# Altium project BLDC_Motor_Driver_MCUBoard.PrjPcb
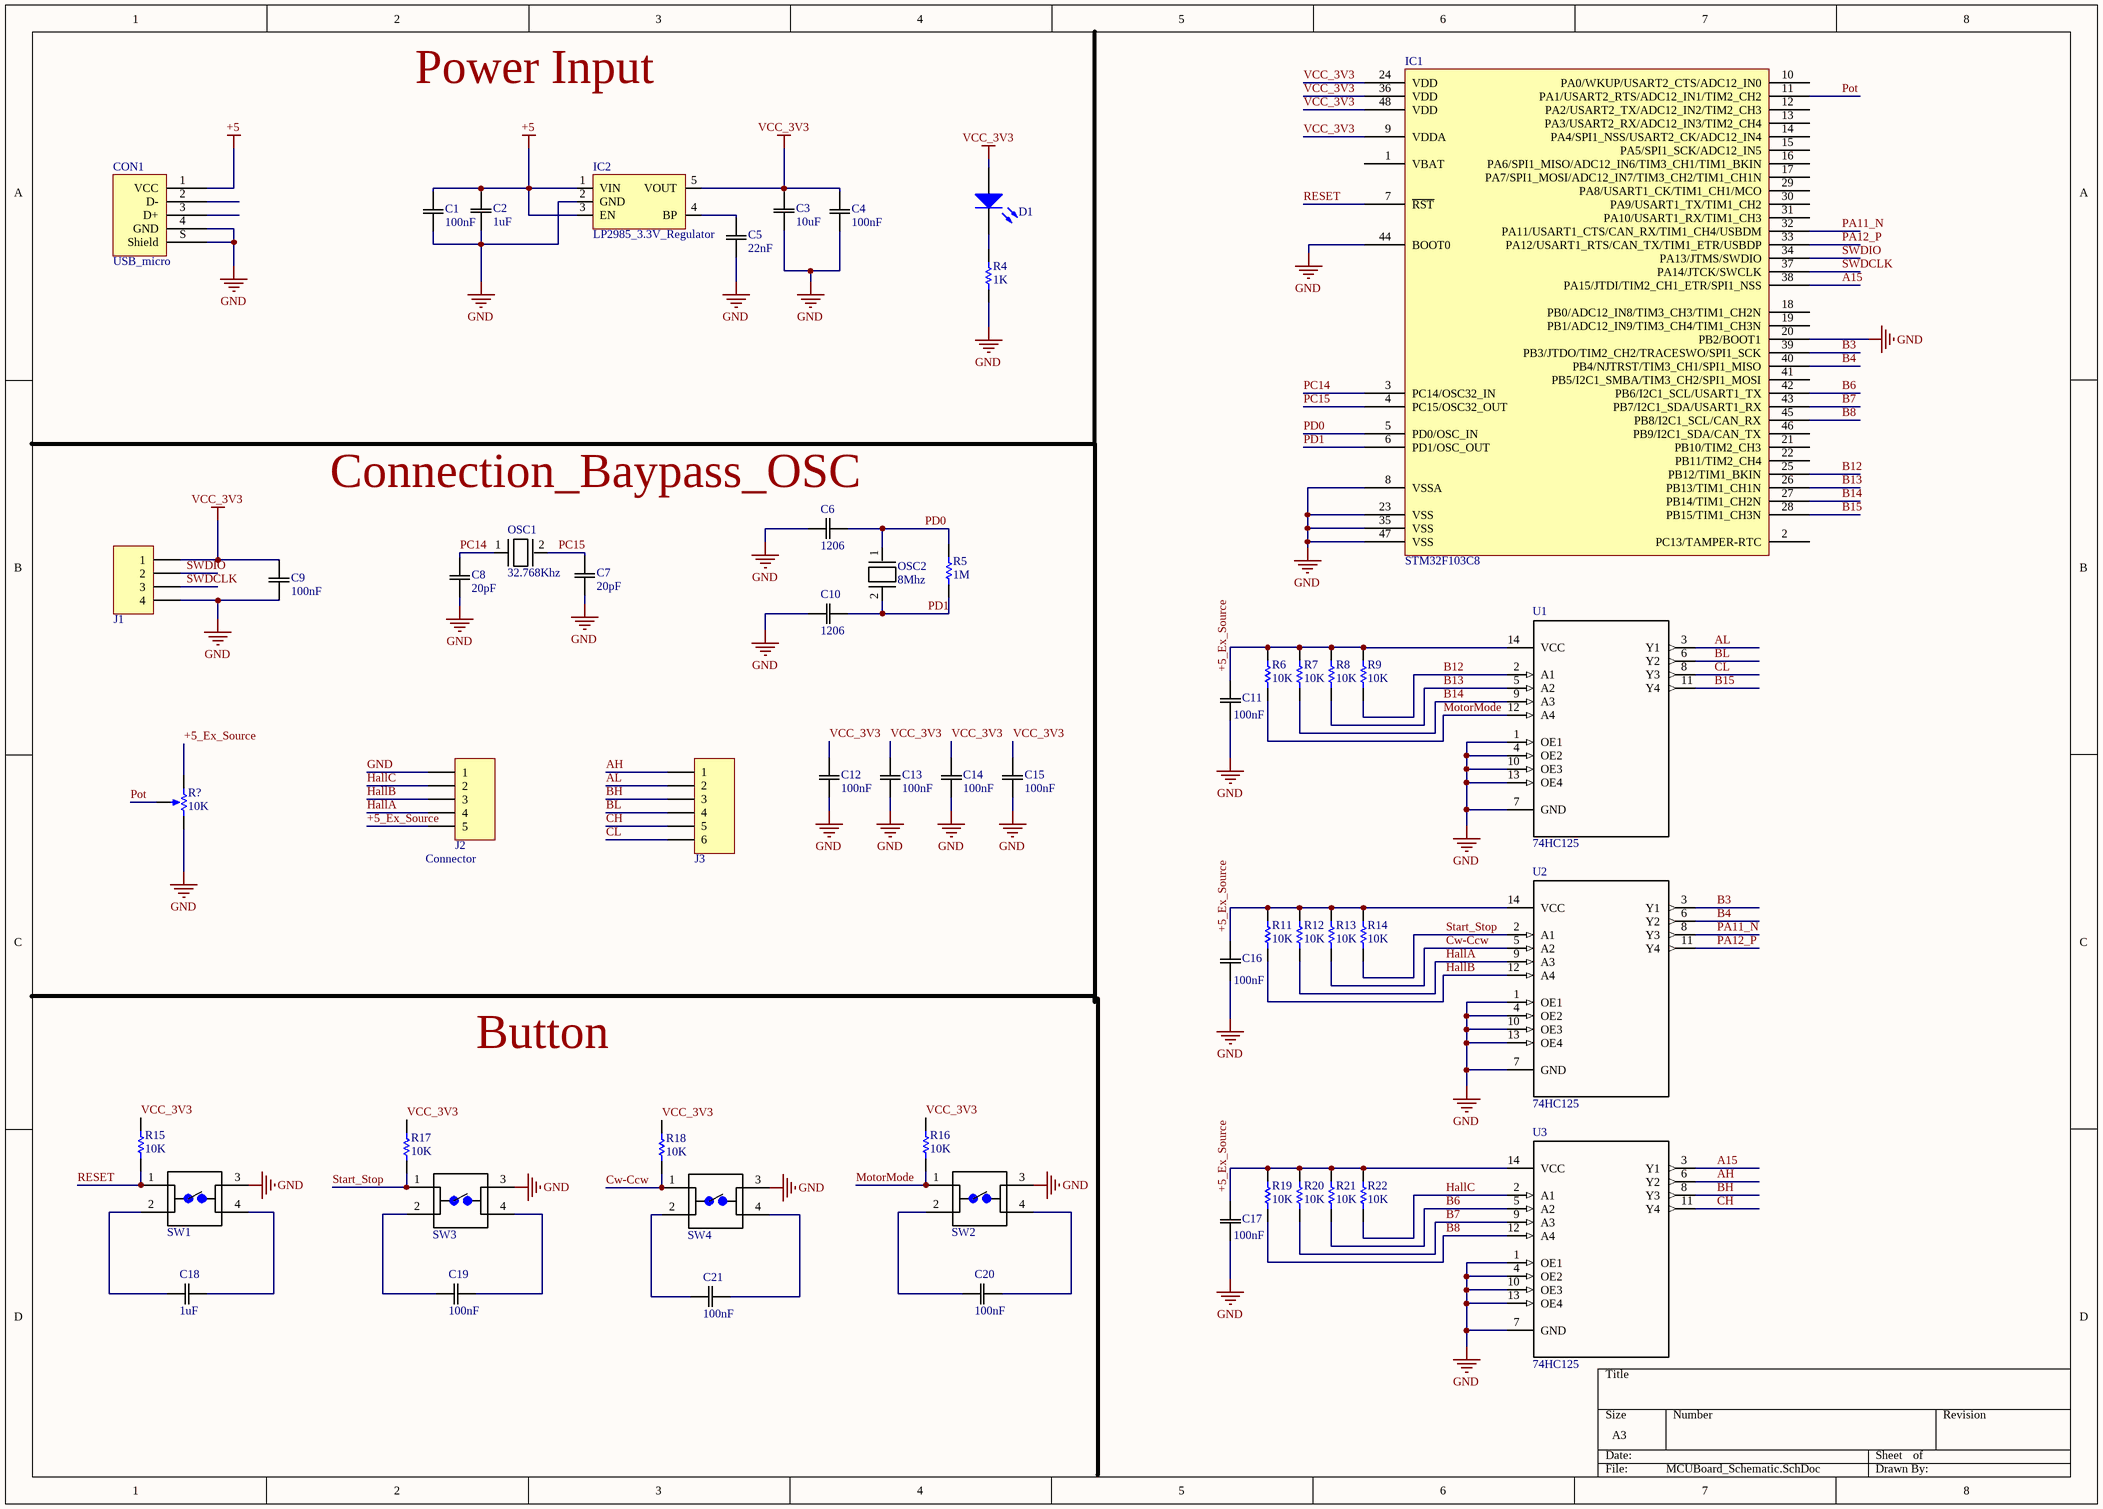
[diagram p0: MCUBoard_Schematic.SchDoc]
1 sheet, 56 parts. Net scope: global (net labels, ports and power ports of the same name join across sheets).
Board file: MCUBoard_PCB.PcbDoc

## Sheet MCUBoard_Schematic.SchDoc
size A3

### Parts
C1  100nF  [SMD_1206]
C2  1uF  [SMD_1206]
C3  10uF  [SMD_1206]
C4  100nF  [SMD_1206]
C5  22nF  [SMD_1206]
C6  1206  [SMD_1206]
C7  20pF  [SMD_1206]
C8  20pF  [SMD_1206]
C9  100nF  [SMD_1206]
C10  1206  [SMD_1206]
C11  100nF  [SMD_1206]
C12  100nF  [SMD_1206]
C13  100nF  [SMD_1206]
C14  100nF  [SMD_1206]
C15  100nF  [SMD_1206]
C16  100nF  [SMD_1206]
C17  100nF  [SMD_1206]
C18  1uF  [SMD_1206]
C19  100nF  [SMD_1206]
C20  100nF  [SMD_1206]
C21  100nF  [SMD_1206]
CON1  USB_micro  [USB_Micro]
D1  LED  [LED_SMD_1206]  (value not drawn)
IC1  STM32F103C8  [STM32F103C8]
IC2  LP2985_3.3V_Regulator  [LP2985_3v3V_Regulator]
J1  Header 4x1  [Header 4x1]  (value not drawn)
J2  System: Connector  [Header 5x1 Right Angle]  (hidden comment: Header 5x1)
J3  Header 6x1  [Header 6x1 Right Angle]  (value not drawn)
OSC1  32.768Khz  [Cristal_small]
OSC2  8Mhz  [CRISTAL_SMD]
R4  1K  [RES_SMD_1206]
R5  1M  [RES_SMD_1206]
R6  10K  [RES_SMD_1206]
R7  10K  [RES_SMD_1206]
R8  10K  [RES_SMD_1206]
R9  10K  [RES_SMD_1206]
R11  10K  [RES_SMD_1206]
R12  10K  [RES_SMD_1206]
R13  10K  [RES_SMD_1206]
R14  10K  [RES_SMD_1206]
R15  10K  [RES_SMD_1206]
R16  10K  [RES_SMD_1206]
R17  10K  [RES_SMD_1206]
R18  10K  [RES_SMD_1206]
R19  10K  [RES_SMD_1206]
R20  10K  [RES_SMD_1206]
R21  10K  [RES_SMD_1206]
R22  10K  [RES_SMD_1206]
R?  10K  [POT]
SW1  DIP_4_pin  [SMD_4_PIN]  (value not drawn)
SW2  DIP_4_pin  [SMD_4_PIN]  (value not drawn)
SW3  DIP_4_pin  [SMD_4_PIN]  (value not drawn)
SW4  DIP_4_pin  [SMD_4_PIN]  (value not drawn)
U1  74HC125  [74HC125]
U2  74HC125  [74HC125]
U3  74HC125  [74HC125]

### Nets
+5: C1.2(C2) C2.2(C2) CON1.1(VCC) IC2.1(VIN) IC2.3(EN)
GND: C1.1(C1) C2.1(C1) C3.1(C1) C4.1(C1) C5.1(C1) C6.1(C1) C7.1(C1) C8.1(C1) C9.1(C1) C10.2(C2) C11.1(C1) C12.1(C1) C13.1(C1) C14.1(C1) C15.1(C1) C16.1(C1) C17.1(C1) CON1.4(GND) CON1.S(Shield) IC1.8(VSSA) IC1.20(PB2/BOOT1) IC1.23(VSS) IC1.35(VSS) IC1.44(BOOT0) IC1.47(VSS) IC2.2(GND) J1.4 J2.1 R4.1 R?.2(BOT) SW1.3 SW2.3 SW3.3 SW4.3 U1.1(OE1) U1.4(OE2) U1.7(GND) U1.10(OE3) U1.13(OE4) U2.1(OE1) U2.4(OE2) U2.7(GND) U2.10(OE3) U2.13(OE4) U3.1(OE1) U3.4(OE2) U3.7(GND) U3.10(OE3) U3.13(OE4)
VCC_3V3: C3.2(C2) C4.2(C2) C9.2(C2) C12.2(C2) C13.2(C2) C14.2(C2) C15.2(C2) D1.1(A) IC1.9(VDDA) IC1.24(VDD) IC1.36(VDD) IC1.48(VDD) IC2.5(VOUT) J1.1 R15.2 R16.2 R17.2 R18.2
+5_Ex_Source: C11.2(C2) C16.2(C2) C17.2(C2) J2.5 R6.2 R7.2 R8.2 R9.2 R11.2 R12.2 R13.2 R14.2 R19.2 R20.2 R21.2 R22.2 R?.1(TOP) U1.14(VCC) U2.14(VCC) U3.14(VCC)
A15: IC1.38(PA15/JTDI/TIM2_CH1_ETR/SPI1_NSS) U3.3(Y1)
AH: J3.1 U3.6(Y2)
AL: J3.2 U1.3(Y1)
B3: IC1.39(PB3/JTDO/TIM2_CH2/TRACESWO/SPI1_SCK) U2.3(Y1)
B4: IC1.40(PB4/NJTRST/TIM3_CH1/SPI1_MISO) U2.6(Y2)
B6: IC1.42(PB6/I2C1_SCL/USART1_TX) R21.1 U3.5(A2)
B7: IC1.43(PB7/I2C1_SDA/USART1_RX) R20.1 U3.9(A3)
B8: IC1.45(PB8/I2C1_SCL/CAN_RX) R19.1 U3.12(A4)
B12: IC1.25(PB12/TIM1_BKIN) R9.1 U1.2(A1)
B13: IC1.26(PB13/TIM1_CH1N) R8.1 U1.5(A2)
B14: IC1.27(PB14/TIM1_CH2N) R7.1 U1.9(A3)
B15: IC1.28(PB15/TIM1_CH3N) U1.11(Y4)
BH: J3.3 U3.8(Y3)
BL: J3.4 U1.6(Y2)
CH: J3.5 U3.11(Y4)
CL: J3.6 U1.8(Y3)
Cw-Ccw: R13.1 R18.1 SW4.1 U2.5(A2)
HallA: J2.4 R12.1 U2.9(A3)
HallB: J2.3 R11.1 U2.12(A4)
HallC: J2.2 R22.1 U3.2(A1)
MotorMode: R6.1 R16.1 SW2.1 U1.12(A4)
PA11_N: IC1.32(PA11/USART1_CTS/CAN_RX/TIM1_CH4/USBDM) U2.8(Y3)
PA12_P: IC1.33(PA12/USART1_RTS/CAN_TX/TIM1_ETR/USBDP) U2.11(Y4)
PC14: C8.2(C2) IC1.3(PC14/OSC32_IN) OSC1.1
PC15: C7.2(C2) IC1.4(PC15/OSC32_OUT) OSC1.2
PD0: C6.2(C2) IC1.5(PD0/OSC_IN) OSC2.1 R5.2
PD1: C10.1(C1) IC1.6(PD1/OSC_OUT) OSC2.2 R5.1
Pot: IC1.11(PA1/USART2_RTS/ADC12_IN1/TIM2_CH2) R?.3(TAP)
RESET: IC1.7(~{RST}) R15.1 SW1.1
Start_Stop: R14.1 R17.1 SW3.1 U2.2(A1)
SWDCLK: IC1.37(PA14/JTCK/SWCLK) J1.3
SWDIO: IC1.34(PA13/JTMS/SWDIO) J1.2
NetC5_2: C5.2(C2) IC2.4(BP)
NetC18_1: C18.1(C1) SW1.2
NetC18_2: C18.2(C2) SW1.4
NetC19_1: C19.1(C1) SW3.2
NetC19_2: C19.2(C2) SW3.4
NetC20_1: C20.1(C1) SW2.2
NetC20_2: C20.2(C2) SW2.4
NetC21_1: C21.1(C1) SW4.2
NetC21_2: C21.2(C2) SW4.4
NetD1_2: D1.2(K) R4.2

Not connected (* = marked no-connect by the designer): CON1 2(D-) 3(D+); IC1 1(VBAT) 2(PC13/TAMPER-RTC) 10(PA0/WKUP/USART2_CTS/ADC12_IN0) 12(PA2/USART2_TX/ADC12_IN2/TIM2_CH3) 13(PA3/USART2_RX/ADC12_IN3/TIM2_CH4) 14(PA4/SPI1_NSS/USART2_CK/ADC12_IN4) 15(PA5/SPI1_SCK/ADC12_IN5) 16(PA6/SPI1_MISO/ADC12_IN6/TIM3_CH1/TIM1_BKIN) 17(PA7/SPI1_MOSI/ADC12_IN7/TIM3_CH2/TIM1_CH1N) 18(PB0/ADC12_IN8/TIM3_CH3/TIM1_CH2N) 19(PB1/ADC12_IN9/TIM3_CH4/TIM1_CH3N) 21(PB10/TIM2_CH3) 22(PB11/TIM2_CH4) 29(PA8/USART1_CK/TIM1_CH1/MCO) 30(PA9/USART1_TX/TIM1_CH2) 31(PA10/USART1_RX/TIM1_CH3) 41(PB5/I2C1_SMBA/TIM3_CH2/SPI1_MOSI) 46(PB9/I2C1_SDA/CAN_TX)

### Notes on the sheet
- Power Input
- (near C6) Connection_Baypass_OSC
- Button

### Library data of the parts
C1-C21 = SMD_1206
OSC1 = Cristal_small
OSC2 = Cristal
R4-R9 R11-R22 = RES
R? = Pot
U1-U3 = 74HC125: 74HC125 - SMD